# EAGLE schematic Schematic v1.0 (EAGLE 9.7.0)
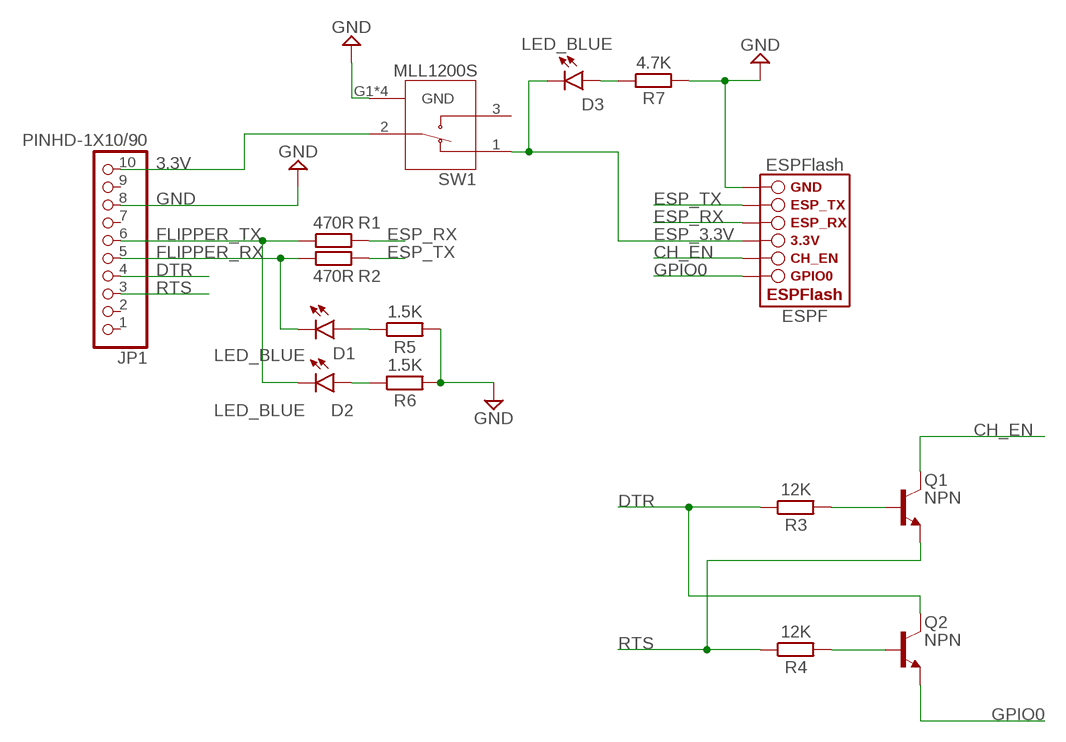
[diagram p0: schematic, sheet 1]

## Parts
D1  LED_BLUE  CHIP-FLAT-B_0603-0.55MM  [LEDC1608X55N_FLAT-B]
D2  LED_BLUE  CHIP-FLAT-B_0603-0.55MM  [LEDC1608X55N_FLAT-B]
D3  LED_BLUE  CHIP-FLAT-B_0603-0.55MM  [LEDC1608X55N_FLAT-B]
ESPF  ESPFLASH-1X6-2.54-PLAIN  [1X6-2.54-PLAIN]
JP1  PINHD-1X10/90  [1X10/90]
Q1  NPN  NPN_SOT23-BEC  [SOT95P237X112-3N]
Q2  NPN  NPN_SOT23-BEC  [SOT95P237X112-3N]
R1  470R  R_CHIP-0603(1608-METRIC)  [RESC1608X60]
R2  470R  R_CHIP-0603(1608-METRIC)  [RESC1608X60]
R3  12K  R_CHIP-0603(1608-METRIC)  [RESC1608X60]
R4  12K  R_CHIP-0603(1608-METRIC)  [RESC1608X60]
R5  1.5K  R_CHIP-0603(1608-METRIC)  [RESC1608X60]
R6  1.5K  R_CHIP-0603(1608-METRIC)  [RESC1608X60]
R7  4.7K  R_CHIP-0603(1608-METRIC)  [RESC1608X60]
SW1  MLL1200S  [SW_MLL1200S]

## Nets
3.3V [Power]: JP1.10 SW1.2
CH_EN: ESPF.5(CH_EN) Q1.3(C)
DTR: JP1.4 Q2.3(C) R3.1
ESP_3.3V [Power]: D3.C ESPF.4(3.3V) SW1.1
ESP_RX: ESPF.3(ESP_RX) R1.2
ESP_TX: ESPF.2(ESP_TX) R2.2
FLIPPER_RX: D1.C JP1.5 R2.1
FLIPPER_TX: D2.C JP1.6 R1.1
GND [Power]: ESPF.1(GND) JP1.8 R5.2 R6.2 R7.2 SW1.G1(GND) SW1.G2(GND) SW1.G3(GND) SW1.G4(GND)
GPIO0: ESPF.6(GPIO0) Q2.2(E)
N$2: D1.A R5.1
N$3: Q1.1(B) R3.2
N$4: D2.A R6.1
N$5: Q2.1(B) R4.2
N$6: D3.A R7.1
RTS: JP1.3 Q1.2(E) R4.1
Unconnected: JP1.1 JP1.2 JP1.7 JP1.9 SW1.3

## Library data of the parts
D1-D3 = LED:CHIP-FLAT-B; CATEGORY: LED; COLOR: BLUE; DESCRIPTION: CHIP LED FLAT; SUB-CATEGORY: CHIP; TYPE: FLAT_TOP
ESPF = SuperHouse-ESPFlash:ESPFLASH: ESPFlash ESPFlash programming header for ESP8266, ESP8285, and ESP32. Options for both 1x6 and 2x3 formats, in both 2.54mm (0.1") and 1.27mm (0.05") pitch.
JP1 = Connector:PINHD-1X10: PIN HEADER; CATEGORY: CONNECTOR; SUB-CATEGORY: PIN-HEADER
Q1 Q2 = Transistor:NPN: NPN - Generic; CATEGORY: Transistor; SUB-CATEGORY: BJT; TYPE: NPN
R1-R7 = Resistor:R: Resistor Fixed - Generic; CATEGORY: Resistor; SUB-CATEGORY: Fixed
SW1 = MLL1200S:MLL1200S: Switch Slide SPDT Side Slide 0.3A 4VDC Gull Wing SMD Box; COMMENT: 1437575-1

## Net classes
0 default: width 0.254 mm
1 Power: width 0.508 mm